# EAGLE design imp-watt-meter (EAGLE 7.4.0)
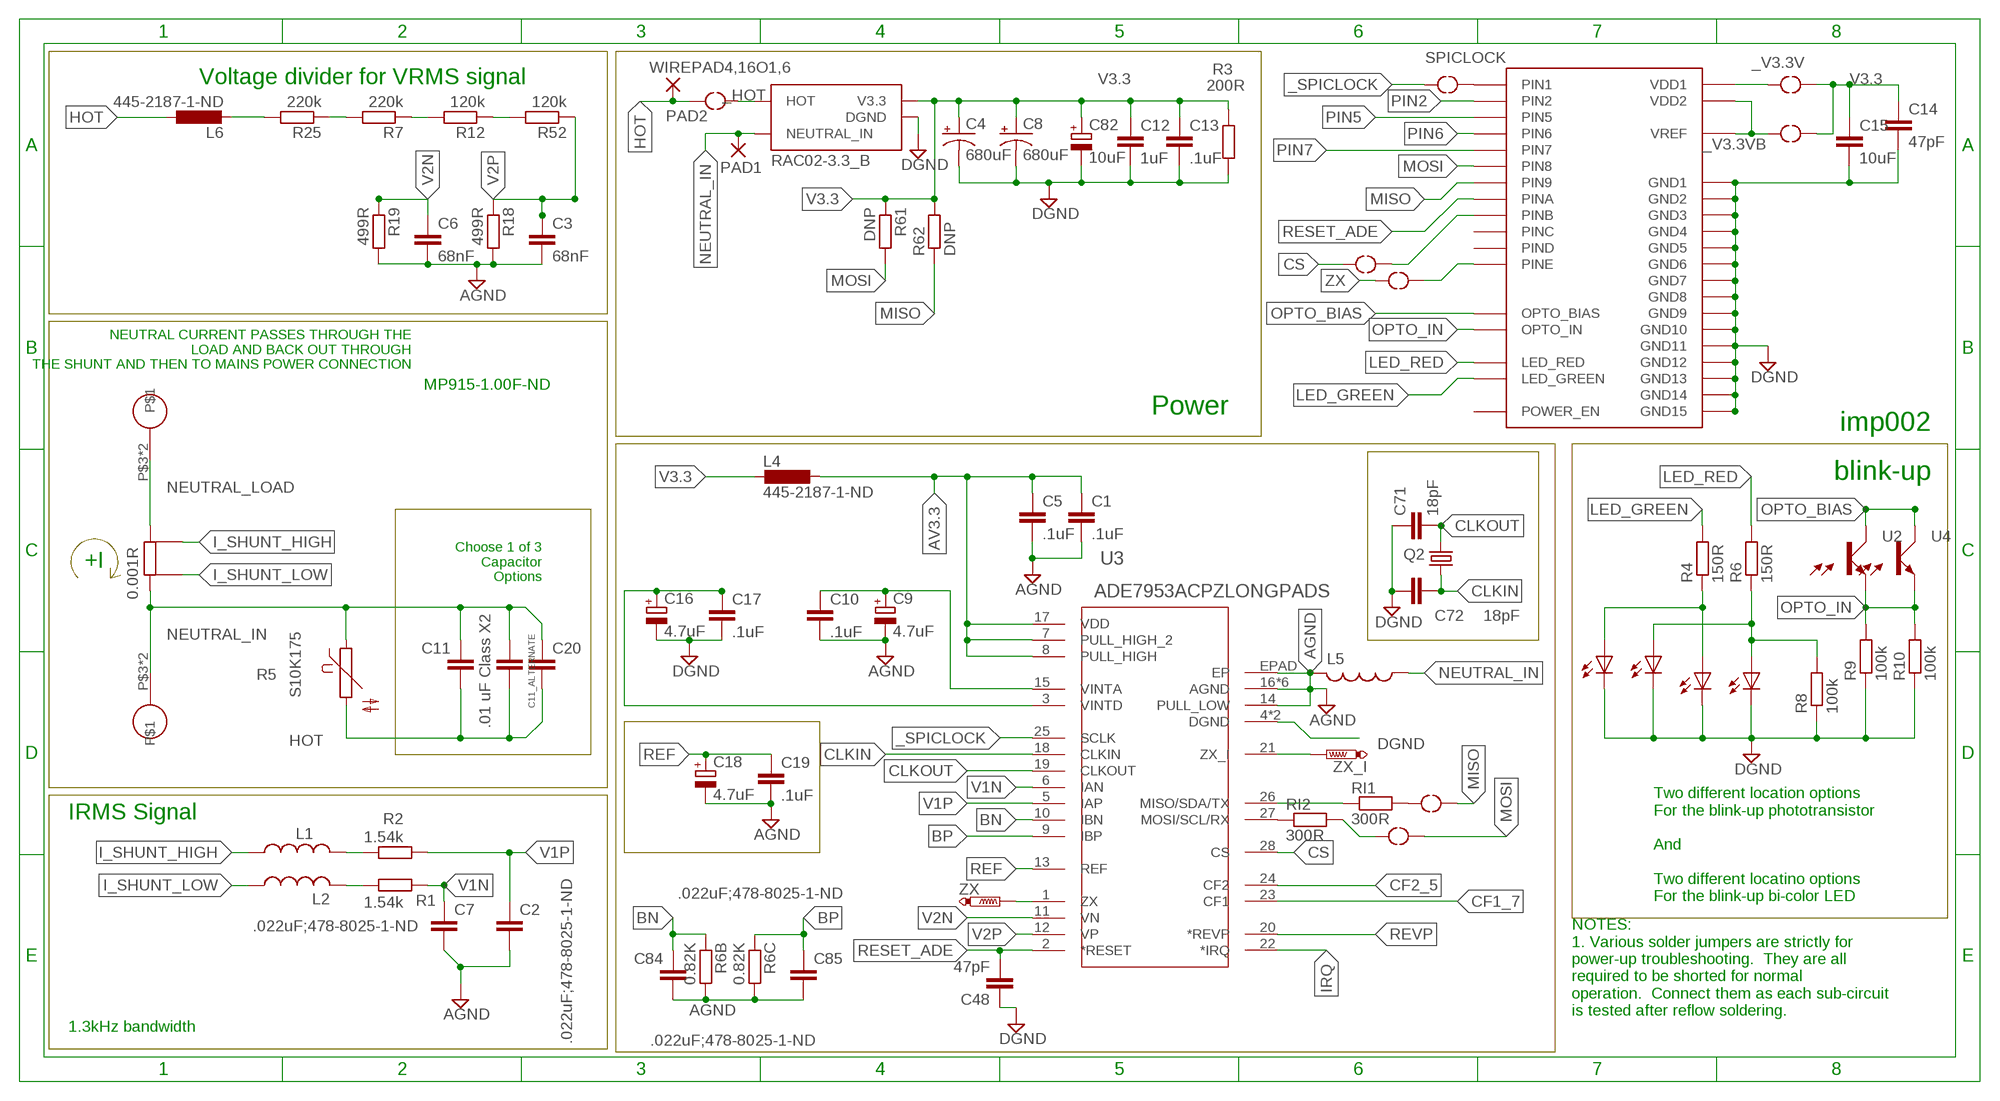
[diagram p0: schematic, sheet 1]

## Parts
0.001R  WSLP2726L5000FEA  [WSLP276_VISHAY]
C1  .1uF  C-EUC0805K  [C0805K@1]
C2  .022uF;478-8025-1-ND  C-EUC0805K  [C0805K@1]
C3  68nF  C-EUC0805K  [C0805K@1]
C4  680uF  CAP_POLD  [PANASONIC_D]
C5  .1uF  C-EUC0805K  [C0805K@1]
C6  68nF  C-EUC0805K  [C0805K@1]
C7  .022uF;478-8025-1-ND  C-EUC0805K  [C0805K@1]
C8  680uF  CAP_POLD  [PANASONIC_D]
C9  4.7uF  CPOL-EUA/3216-18R  [A/3216-18R]
C10  .1uF  C-EUC0805K  [C0805K@1]
C11  .01 uF Class X2  C-EUC2220K  [C2220K]
C11_ALTERNATE  .01 uF Class X2  C-EUC2220K  [C2220K]
C12  1uF  C-EUC1206K  [C1206K]
C13  .1uF  C-EUC0805K  [C0805K@1]
C14  47pF  C-EUC0805K  [C0805K@1]
C15  10uF  CAP1206  [1206]
C16  4.7uF  CPOL-EUA/3216-18R  [A/3216-18R]
C17  .1uF  C-EUC0805K  [C0805K@1]
C18  4.7uF  CPOL-EUA/3216-18R  [A/3216-18R]
C19  .1uF  C-EUC0805K  [C0805K@1]
C20  C10/4  [C10B4]
C48  47pF  C-EUC0805K  [C0805K@1]
C71  18pF  C-EUC0805K  [C0805K@1]
C72  18pF  C-EUC0805K  [C0805K@1]
C82  10uF  CPOL-EUA/3216-18R  [A/3216-18R]
C84  .022uF;478-8025-1-ND  C-EUC0805K  [C0805K@1]
C85  .022uF;478-8025-1-ND  C-EUC0805K  [C0805K@1]
L1  L-USL4516C  [L4516C]
L2  L-USL4516C  [L4516C]
L4  445-2187-1-ND  L-EUL2012C  [L2012C]
L5  L-USL4516C  [L4516C]
L6  445-2187-1-ND  L-EUL2012C  [L2012C]
PAD1  WIREPAD4,16O1,6  [4,16O1,6]
PAD2  WIREPAD4,16O1,6  [4,16O1,6]
Q2  535-10200-1-ND  CRYSTALSM49  [SM49]
R1  1.54k  R-EU_  [C0805K]
R2  1.54k  R-EU_  [C0805K]
R3  200R  R-EU_M1206  [M1206]
R4  150R  R-EU_R0805  [R0805]
R5  S10K175  [S10K175]
R6  150R  R-EU_R0805  [R0805]
R6B  0.82K  R-EU_  [C0805K]
R6C  0.82K  R-EU_  [C0805K]
R7  220k  R-EU_R2010  [R2010]
R8  100k  R-EU_R0805  [R0805]
R9  100k  R-EU_R0805  [R0805]
R10  100k  R-EU_R0805  [R0805]
R12  120k  R-EU_M1206  [M1206]
R18  499R  R-EU_  [C0805K]
R19  499R  R-EU_  [C0805K]
R25  220k  R-EU_R2010  [R2010]
R52  120k  R-EU_M1206  [M1206]
R61  DNP  R-EU_  [C0805K]
R62  DNP  R-EU_  [C0805K]
RI1  300R  R-US_R0805  [R0805@1]
RI2  300R  R-US_R0805  [R0805@1]
U1  LED_DUAL  [LED-BICOLOR]
U2  PHOTOTRANSISTOR0603  [0603]
U3  ADE7953ACPZLONGPADS  ADE7953ACPZ5.0  [VQFN-28-D]
U4  PHOTOTRANSISTOR0603  [0603]
U5  LED_DUAL  [LED-BICOLOR]
U$1  RAC02-3.3_B  [RAC02_B]
U$2  KEYSTONE_FASTON  [KEYSTONE_FASTON_0.25]
U$5  IMP002MANUFACTURING  [IMP002]
U$10  JUMPER2B  [SOLDER_JUMPER2B]
U$11  JUMPER2B  [SOLDER_JUMPER2B]
U$12  JUMPER2B  [SOLDER_JUMPER2B]
U$13  JUMPER2B  [SOLDER_JUMPER2B]
U$15  JUMPER2B  [SOLDER_JUMPER2B]
U$16  JUMPER3  [SOLDER_JUMPER3]
U$17  KEYSTONE_FASTON  [KEYSTONE_FASTON_0.25]
U$18  JUMPER3  [SOLDER_JUMPER3]
U$19  JUMPER2B  [SOLDER_JUMPER2B]
ZX  PTR1TP08R  [TP08R]
ZX_I  PTR1TP08R  [TP08R]

## Nets
_31 [ic]: R12.1 R52.2
_61 [HIGHVOLTAGE]: R7.1 R12.2
_118 [HIGHVOLTAGE]: R7.2 R25.1
_CS [ic]: U$5.PAD9(PINB) U$10.P$1
_HOT [HIGHVOLTAGE]: U$1.P$2(HOT) U$1.P$7(HOT) U$19.P$2
_I2C_CLOCK_1: RI2.2 U$12.P$2
_I2C_DATA_2: RI1.2 U$13.P$2
_PINE: U$5.PAD12(PINE) U$15.P$1
_SPICLOCK [ic]: U3.25(SCLK) U$11.P$2
_V3.3V: U$5.PAD18(VDD1) U$16.P$2
_V3.3VB: U$5.PAD33(VDD2) U$5.PAD34(VREF) U$18.P$2
AGND: C1.2 C2.2 C3.2 C5.2 C6.2 C7.2 C9.- C10.2 C18.- C19.2 C84.2 C85.2 L5.2 R6B.2 R6C.2 R18.2 R19.2 U3.14(PULL_LOW) U3.16(AGND) U3.29(AGND) U3.30(AGND) U3.31(AGND) U3.32(AGND) U3._AGND(AGND) U3.EPAD(EP)
AV3.3 [ic]: C1.1 C5.1 L4.1 U3.7(PULL_HIGH_2) U3.8(PULL_HIGH) U3.17(VDD)
BN [ic]: C84.1 R6B.1 U3.10(IBN)
BP [ic]: C85.1 R6C.1 U3.9(IBP)
CALIBRATE_HIGH [HIGHVOLTAGE]: L6.2 R25.2
CF1_7 [ic]: U3.23(CF1)
CF2_5 [ic]: U3.24(CF2)
CLKIN [ic]: C72.2 Q2.1 U3.18(CLKIN)
CLKOUT [ic]: C71.2 Q2.2 U3.19(CLKOUT)
CS [ic]: U3.28(CS) U$10.P$2
DGND: C4.- C8.- C12.2 C13.2 C14.2 C15.2 C16.- C17.2 C48.1 C71.1 C72.1 C82.- R3.2 R8.1 R9.1 R10.1 U1.3(C) U1.4(C) U3.4(DGND) U3._DGND(DGND) U5.3(C) U5.4(C) U$1.P$3(DGND) U$1.P$5(DGND) U$1.P$8(DGND) U$1.P$10(DGND) U$5.PAD1(GND1) U$5.PAD7(GND2) U$5.PAD13(GND3) U$5.PAD17(GND4) U$5.PAD23(GND5) U$5.PAD24(GND6) U$5.PAD25(GND7) U$5.PAD26(GND8) U$5.PAD27(GND9) U$5.PAD28(GND10) U$5.PAD29(GND11) U$5.PAD30(GND12) U$5.PAD31(GND13) U$5.PAD32(GND14) U$5.PAD35(GND15)
HOT [HIGHVOLTAGE]: C11.1 C11_ALTERNATE.1 C20.2 L6.1 PAD2.1(P) R5.2 U$19.P$1
I_SHUNT_HIGH [ic]: 0.001R.P$3 L1.1
I_SHUNT_LOW [ic]: 0.001R.P$4 L2.1
IRQ [ic]: U3.22(*IRQ)
LED_GREEN: R4.2 U$5.PAD3(LED_GREEN)
LED_RED: R6.2 U$5.PAD4(LED_RED)
MISO: R62.1 U$5.PAD14(PIN9) U$13.P$1
MOSI: R61.2 U$5.PAD22(PIN8) U$12.P$1
N$1: L1.2 R2.2
N$2: R4.1 U1.1(A) U5.1(A)
N$3: R6.1 R8.2 U1.2(A) U5.2(A)
NEUTRAL_IN: 0.001R.P$2 0.001R.P$8 0.001R.P$9 0.001R.P$10 C11.2 C11_ALTERNATE.2 C20.1 L5.1 PAD1.1(P) R5.1 U$1.P$1(NEUTRAL_IN) U$1.P$6(NEUTRAL_IN) U$17.P$3 U$17.P$4
NEUTRAL_LOAD: 0.001R.P$1 0.001R.P$5 0.001R.P$6 0.001R.P$7 U$2.P$3 U$2.P$4
OPTO_BIAS: U2.1(C) U4.1(C) U$5.PAD2(OPTO_BIAS)
OPTO_IN: R9.2 R10.2 U2.2(E) U4.2(E) U$5.PAD6(OPTO_IN)
PIN2: U$5.PAD16(PIN2)
PIN5: U$5.PAD19(PIN5)
PIN6: U$5.PAD20(PIN6)
PIN7: U$5.PAD21(PIN7)
PIN26_MISO_SDA_TX [ic]: RI1.1 U3.26(MISO/SDA/TX)
PIN27_MOSI_SCL_RX [ic]: RI2.1 U3.27(MOSI/SCL/RX)
REF [ic]: C18.+ C19.1 U3.13(REF)
RESET_ADE [ic]: C48.2 U3.2(*RESET) U$5.PAD8(PINA)
REVP [ic]: U3.20(*REVP)
SDFSDF: L2.2 R1.2
SPICLOCK [ic]: U$5.PAD15(PIN1) U$11.P$1
V1N [ic]: C7.1 R1.1 U3.6(IAN)
V1P [ic]: C2.1 R2.1 U3.5(IAP)
V2N [ic]: C6.1 R19.1 U3.11(VN)
V2P [ic]: C3.1 R18.1 R52.1 U3.12(VP)
V3.3: C4.+ C8.+ C12.1 C13.1 C14.1 C15.1 C82.+ L4.2 R3.1 R61.1 R62.2 U$1.P$4(V3.3) U$1.P$9(V3.3) U$16.P$1 U$18.P$1
VINTA_DCPL [ic]: C9.+ C10.1 U3.15(VINTA)
VINTD_DCPL [ic]: C16.+ C17.1 U3.3(VINTD)
ZX [ic]: U3.1(ZX) U$15.P$2 ZX.TP
ZX_I [ic]: U3.21(ZX_I) ZX_I.TP
Unconnected: U$5.PAD5(POWER_EN) U$5.PAD10(PINC) U$5.PAD11(PIND)

## Notes on the sheet
- Voltage divider for VRMS signal
- NEUTRAL CURRENT PASSES THROUGH THE
  LOAD AND BACK OUT THROUGH
  THE SHUNT AND THEN TO MAINS POWER CONNECTION
- MP915-1.00F-ND
- Power
- imp002
- blink-up
- Choose 1 of 3
  Capacitor
  Options
- +I
- IRMS Signal
- Two different location options
  For the blink-up phototransistor
  
  And
  
  Two different locatino options
  For the blink-up bi-color LED
- NOTES:
  1. Various solder jumpers are strictly for
  power-up troubleshooting.  They are all
  required to be shorted for normal
  operation.  Connect them as each sub-circuit
  is tested after reflow soldering.
- 1.3kHz bandwidth

## Library data of the parts
0.001R = marks:WSLP2726L5000FEA
C1-C3 C5-C7 C10 C12-C14 C17 C19 C48 C71 C72 C84 C85 = resistor:C-EU: CAPACITOR, European symbol
C4 C8 = SparkFun-Passives:CAP_POL: Capacitor Polarized These are standard SMD and PTH capacitors. Normally 10uF, 47uF, and 100uF in electrolytic and tantalum varieties. Always verify the external diameter of the through hole cap, it varies with capacity, voltage, and manufacturer. The EIA devices should be standard.
C9 C16 C18 C82 = resistor:CPOL-EU: POLARIZED CAPACITOR, European symbol
C11 C11_ALTERNATE = rcl:C-EU: CAPACITOR, European symbol
C15 = SparkFun-Passives:CAP: Capacitor Standard 0603 ceramic capacitor, and 0.1" leaded capacitor.
C20 = capacitor-wima:C: CAPACITOR naming: grid - package width
L1 L2 L5 = rcl:L-US: INDUCTOR, American symbol
L4 L6 = resistor:L-EU: INDUCTOR, European symbol
PAD1 PAD2 = wirepad-marks:WIREPAD: Wire PAD connect wire on PCB
Q2 = crystal:CRYSTAL: CRYSTAL; OC_FARNELL: unknown; OC_NEWARK: unknown
R1-R4 R6 R6B R6C R7-R10 R12 R18 R19 R25 R52 R61 R62 = resistor:R-EU_: RESISTOR, European symbol
R5 = marks:S10K175: VARISTOR
RI1 RI2 = resistor:R-US_: RESISTOR, American symbol
U1 U5 = marks:LED_DUAL
U2 U4 = marks:PHOTOTRANSISTOR0603
U3 = ade7953-2:ADE7953ACPZ
U$1 = recom-international:RAC02-3.3_B
U$2 U$17 = marks:KEYSTONE_FASTON
U$5 = smARtMAKER_Electrc_Imp:IMP002: The imp is a complete wireless network node in a module. It is available both in a memory card form-factor (imp001) and in a solder-down module form-factor (imp002). It works in conjunction with the imp service to allow easy connection of any device to the internet. This component is the solder down module imp002. Download and updates for the component: http://smartmaker.org/wiki/Projects:Eagle_Libraries:imp002 Specifications for the Electric Imp: http://devwiki.electricimp.com/doku.php?id=specs Author: Dimitri Albino - dimitri@smartmaker.org
U$10-U$13 U$15 U$19 = marks:JUMPER2B
U$16 U$18 = marks:JUMPER3
ZX ZX_I = testpad:PTR1: TEST PIN

## Net classes
0 default: width 0.203 mm, drill 0.508 mm, clearance 0.254 mm
1 HIGHVOLTAGE: width 0.254 mm, drill 0.508 mm, clearance 2.413 mm to class 0, clearance 1.27 mm
2 ic: width 0.152 mm, drill 0.305 mm, clearance 0.152 mm to class 0, clearance 2.413 mm to class 1, clearance 0.152 mm

## Board
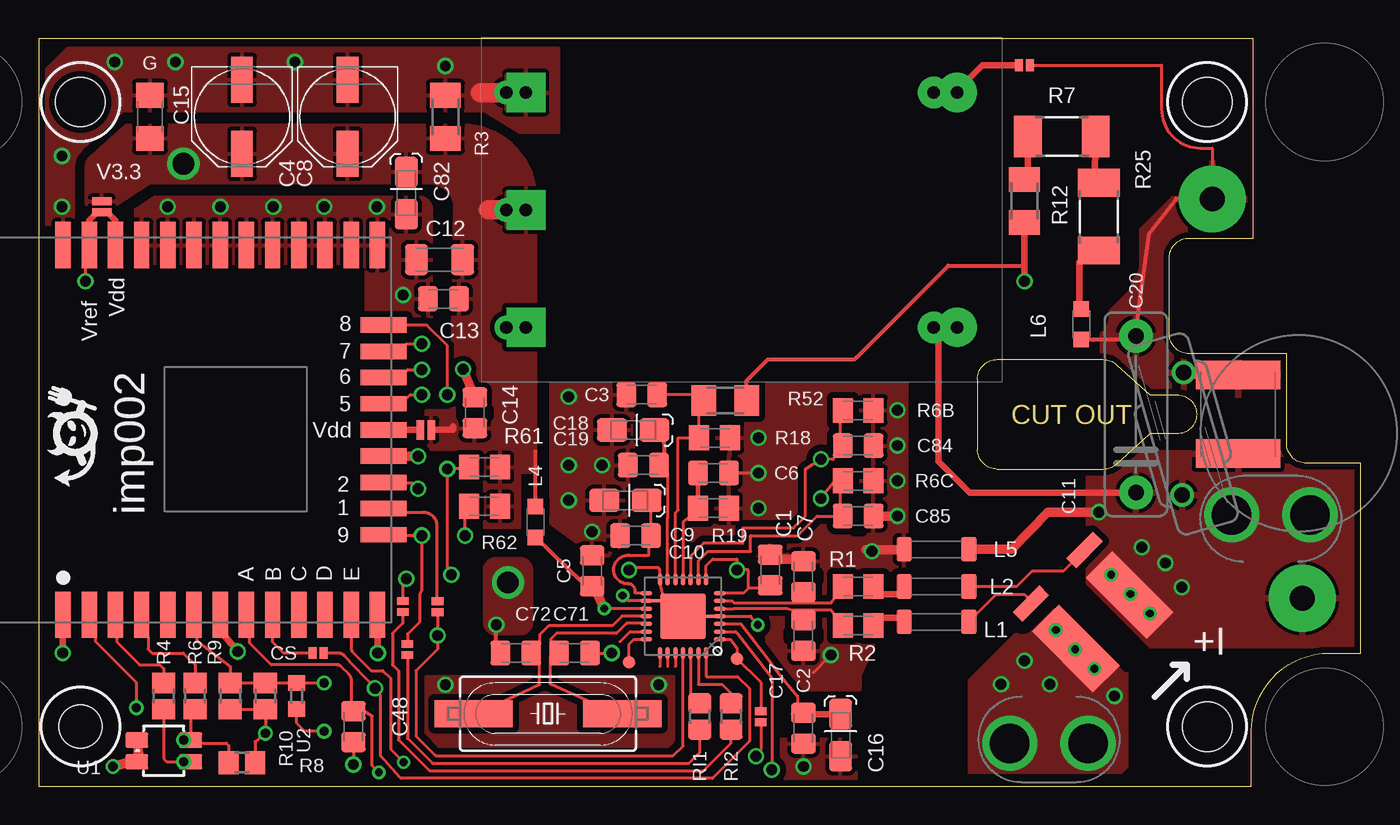
[diagram p1: board, top side]
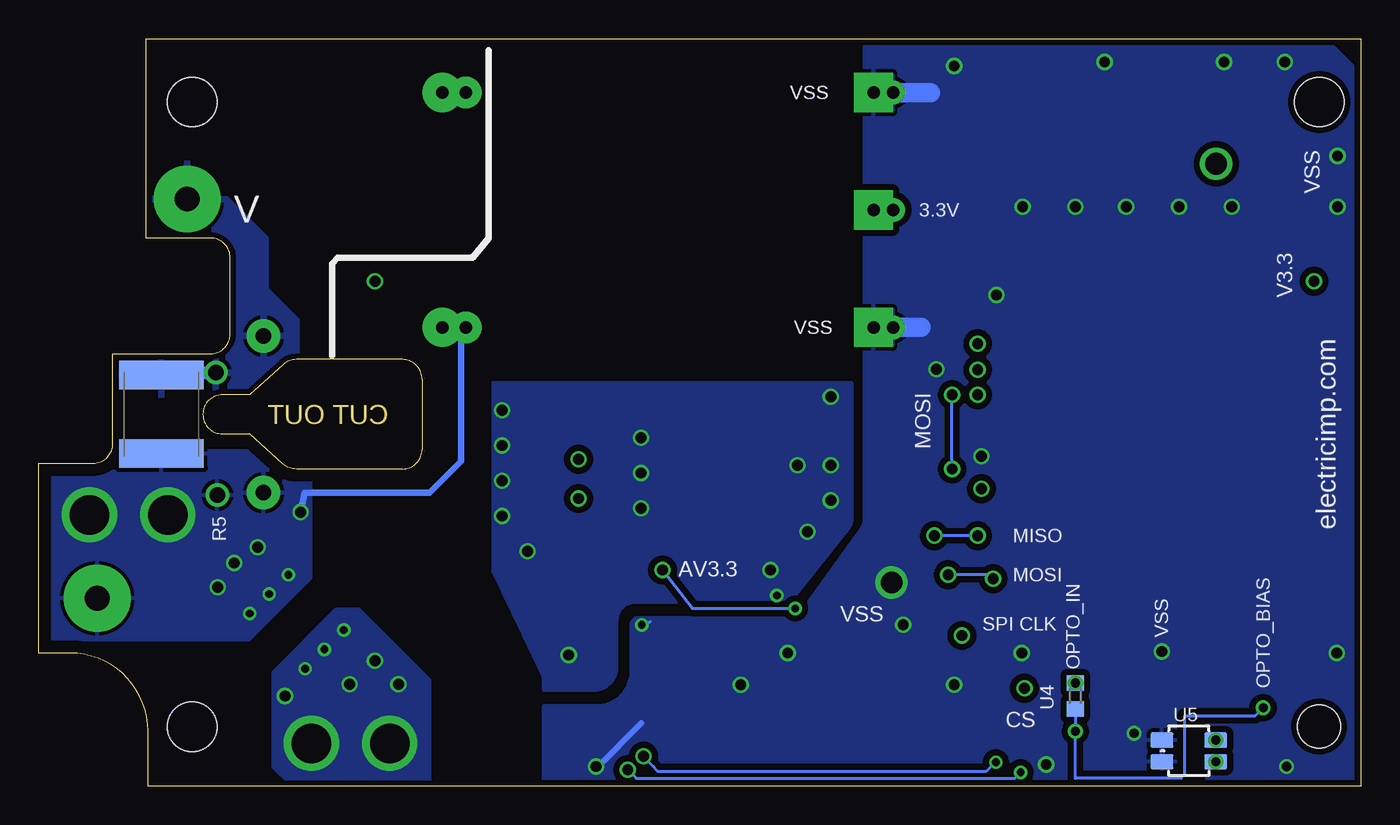
[diagram p2: board, bottom side, seen from below]

Size 85.85 x 48.51 mm. Coordinates in mm from the lower left corner, seen from the top.
Outline: 81.03,28.07 74.68,28.07 arc-90 73.41,29.34 73.41,34.29 arc-90 74.68,35.56 78.87,35.56 78.87,48.51 0,48.51 0,0 78.74,0 78.74,3.56 arc-90 83.82,8.64 85.85,8.64 85.85,20.96 82.3,20.96 arc-90 81.03,22.23 81.03,28.07
Outline: 62.23,27.69 69.11,27.69 arc-42 69.96,27.36 72.14,25.4 73.91,25.4 arc-180 73.91,22.86 72.14,22.86 69.96,20.9 arc-42 69.11,20.57 62.23,20.57 arc-90 60.96,21.84 60.96,26.42 arc-90 62.23,27.69
Copper layers (1*16): Top 0.0356mm / dielectric 1.5011mm / Bottom 0.0356mm
Design rules "LaenPCBOrder2014 *": minimum track width 6mil, minimum drill 13mil, track to track 8mil, track to pad 8mil, pad to pad 8mil, via to via 10mil, smd to smd 8mil, copper to edge 15mil, drill to drill 6mil, minimum pad ring 7mil, minimum via ring 7mil, stop-mask expansion 3mil, vias tented up to drill 0mil, thermal gap 10mil
Holes 2.8 mm at 2.72,3.86
Holes 3.2 mm at 2.72,44.4 75.87,3.86 75.87,44.4
tRestrict: area 3.8,12.8 to 20.8,33.4; area 44.2,23.9 to 45,26.2; area 48,4.1 to 48.5,6.1
bRestrict: area 10.5,0.4 to 10.9,4.1

### Footprints (pad centres in the part's own frame; a part is rotated, then mirrored left to right if it is on the bottom)
WSLP276_VISHAY = smd 5.588 x 2.438: P$1 0,2.464; P$2 0,-2.464 | smd 0.889 x 2.438: P$3 4.128,2.464; P$4 4.128,-2.464 | drill 0.508: P$5 -1.778,2.54; P$6 1.778,2.54; P$7 0,2.54; P$8 -1.778,-2.54; P$9 0,-2.54; P$10 1.778,-2.54
C0805K@1 = smd 1.3 x 1.6: 1 -1,0; 2 1,0
PANASONIC_D = smd 3 x 1.4: + 2.4,0; - -2.4,0
A/3216-18R = smd 1.95 x 1.5: + 1.375,0; - -1.375,0
C2220K = smd 1.85 x 5.5: 1 -2.55,0; 2 2.55,0
C1206K = smd 1.5 x 2: 1 -1.5,0; 2 1.5,0
1206 = smd 1.6 x 1.8: 1 -1.4,0; 2 1.4,0
C10B4 = drill 1.016 pad 2.159: 1 -5.08,0; 2 5.08,0
L4516C = smd 1 x 1.6: 1 -2.1,0; 2 2.1,0
L2012C = smd 1 x 1: 1 -1,0; 2 1,0
4,16O1,6 = drill 1.6 pad 4.318: 1 0,0
SM49 = smd 5.08 x 1.778: 1 -4.826,0; 2 4.826,0
C0805K = smd 1.3 x 1.6: 1 -1,0; 2 1,0
M1206 = smd 1.6 x 2: 1 -1.4,0; 2 1.4,0
R0805 = smd 1.3 x 1.5: 1 -0.85,0; 2 0.85,0
S10K175 = drill 1.016: 1 -1.143,-3.81; 2 1.143,3.81
R2010 = smd 1.8 x 2.7: 1 -2.2,0; 2 2.2,0
R0805@1 = smd 1.3 x 1.5: 1 -0.85,0; 2 0.85,0
LED-BICOLOR = smd 1.5 x 1: 1 -1.75,0.7; 2 -1.75,-0.7; 3 1.75,0.7; 4 1.75,-0.7
0603 = smd 1 x 1.1: 1 -0.85,0; 2 0.85,0
VQFN-28-D = smd 0.813 x 0.305: 1 -2.388,1.5; 2 -2.388,1; 3 -2.388,0.5; 4 -2.388,0; 5 -2.388,-0.5; 6 -2.388,-1; 7 -2.388,-1.5; 15 2.388,-1.5; 16 2.388,-1; 17 2.388,-0.5; 18 2.388,0; 19 2.388,0.5; 20 2.388,1; 21 2.388,1.5 | smd 0.305 x 0.813: 8 -1.5,-2.388; 9 -1,-2.388; 10 -0.5,-2.388; 11 0,-2.388; 12 0.5,-2.388; 13 1,-2.388; 14 1.5,-2.388; 22 1.5,2.388; 23 1,2.388; 24 0.5,2.388; 25 0,2.388; 26 -0.5,2.388; 27 -1,2.388; 28 -1.5,2.388 | smd 1.016 x 1.016: 29 -0.762,0.762; 30 -0.762,-0.762; 31 0.762,0.762; 32 0.762,-0.762 | smd 0.762 x 0.203: _AGND 1.778,-1; _DGND -1.651,0 | smd 2.946 x 2.946: EPAD 0,0
RAC02_B = drill 0.8 pad 2.54: P$1 0,7.62; P$2 0,-7.62 | drill 0.8 pad 2.54 square: P$3 28,7.62; P$4 28,0; P$5 28,-7.62 | drill 0.8 pad 2.032: P$6 1.524,7.62; P$7 1.524,-7.62 | drill 0.8 pad 1.524: P$8 29.27,7.62; P$9 29.27,0; P$10 29.27,-7.62
KEYSTONE_FASTON_0.25 = drill 2.565: P$3 -2.54,0.635; P$4 2.54,0.635
IMP002 = smd 3 x 1: PAD1 -12,7.8; PAD2 -12,6.1; PAD3 -12,4.4; PAD4 -12,2.7; PAD5 -12,1; PAD6 -12,-0.7; PAD7 -12,-2.4; PAD8 -12,-4.1; PAD9 -12,-5.8; PAD10 -12,-7.5; PAD11 -12,-9.2; PAD12 -12,-10.9; PAD13 -12,-12.6; PAD23 12,-12.6; PAD24 12,-10.9; PAD25 12,-9.2; PAD26 12,-7.5; PAD27 12,-5.8; PAD28 12,-4.1; PAD29 12,-2.4; PAD30 12,-0.7; PAD31 12,1; PAD32 12,2.7; PAD33 12,4.4; PAD34 12,6.1; PAD35 12,7.8 | smd 1 x 3: PAD14 -6.8,-13; PAD15 -5.1,-13; PAD16 -3.4,-13; PAD17 -1.7,-13; PAD18 0,-13; PAD19 1.7,-13; PAD20 3.4,-13; PAD21 5.1,-13; PAD22 6.8,-13
SOLDER_JUMPER2B = smd 0.508 x 0.762: P$1 -0.356,0; P$2 0.356,0
SOLDER_JUMPER3 = smd 1.27 x 0.508: P$1 0,0.356; P$2 0,-0.356
TP08R = smd 0.8 x 0.8: TP 0,0

### Placement (x,y rotation side)
0.001R  69.09,10.67 135 top
C1  47.5,14.02 90 top
C2  49.66,9.78 270 top
C3  39.17,25.4 180 top
C4  13.21,43.43 270 top
C5  35.94,13.97 90 top
C6  43.81,20.32 0 top
C7  49.66,13.59 90 top
C8  20.07,43.43 270 top
C9  38.1,18.54 0 top
C10  38.76,16.26 180 top
C11  77.88,24.13 270 top
C11_ALTERNATE  77.88,24.13 270 bottom
C12  26.04,34.16 180 top
C13  26.29,31.62 180 top
C14  28.32,24.23 90 top
C15  7.24,43.43 90 top
C16  52.07,3.3 90 top
C17  49.66,3.76 270 top
C18  38.61,23.11 0 top
C19  39.27,20.83 180 top
C20  71.25,24.13 90 top
C48  20.45,3.86 90 top
C71  34.8,8.64 180 top
C72  30.99,8.64 0 top
C82  23.88,38.48 90 top
C84  53.21,22.1 0 top
C85  53.21,17.53 0 top
L1  58.29,10.67 180 top
L2  58.29,12.95 180 top
L4  32.26,17.14 90 top
L5  58.29,15.37 180 top
L6  67.69,29.97 90 top
PAD1  82.04,12.19 0 top
PAD2  76.2,38.1 0 top
Q2  33.07,4.7 0 top
R1  53.21,12.95 0 top
R2  53.21,10.41 0 top
R3  26.42,43.43 90 top
R4  8.13,5.84 90 top
R5  74.3,22.86 16 top
R6  10.16,5.84 90 top
R6B  53.21,24.38 0 top
R6C  53.21,19.81 0 top
R7  66.42,42.16 0 top
R8  13.21,1.52 180 top
R9  12.45,5.84 90 top
R10  14.73,5.84 90 top
R12  64.01,37.97 90 top
R18  43.89,22.61 0 top
R19  43.81,18.03 0 top
R25  68.83,36.96 270 top
R52  44.58,25.02 0 top
R61  28.96,20.7 180 top
R62  28.96,18.16 0 top
RI1  42.93,4.52 270 top
RI2  44.96,4.52 270 top
U1  8.13,2.29 180 top
U2  16.76,5.84 90 top
U3  41.84,11.03 180 top
U4  18.54,5.84 90 bottom
U5  11.18,2.29 180 bottom
U$1  59.64,37.39 180 top
U$2  65.59,3.41 180 top
U$5  9.4,23.11 90 top
U$10  18.16,8.64 0 top
U$11  25.91,11.63 270 top
U$12  23.65,11.66 270 top
U$13  23.95,8.86 270 top
U$15  46.89,4.49 90 top
U$16  25.15,23.11 270 top
U$17  80,16.97 0 top
U$18  4.11,37.59 0 top
U$19  64.01,46.79 180 top
ZX  45.34,8.28 0 top
ZX_I  38.34,8.03 90 top

### Tracks (layer width: path | path; a pad name or v marks a point on that pad's centre or on a via)
_31  (via drill 0.7)
  Top 0.254: R52.2 45.98,26.31 47.35,27.69 52.58,27.69 52.96,27.69 53.09,27.81 59.05,33.78 64.01,33.78
  Top 0.406: R12.1 64.01,33.78 v64.01,32.77
_61
  Top 0.406: R7.1 64.22,39.08 R12.2
_118
  Top 0.406: R7.2 68.58,39.12 68.83,39.12 68.62,38.82 69.09,38.61 69.05,38.61 R25.1
_CS
  Top 0.203: 15.24,11.07 U$5.PAD9 15.2,9.34 15.9,8.64 U$10.P$1
_HOT
  Top 0.406: U$19.P$2 61.27,46.79 59.69,45.21 U$1.P$2 U$1.P$7
_I2C_CLOCK_1
  Top 0.203: U$12.P$2 23.65,10.57 22.99,9.91 22.99,7.87 23.37,7.49 23.37,3 25.4,0.99 43.16,0.99 44.96,2.79 RI2.2
_I2C_DATA_2
  Top 0.203: U$13.P$2 23.95,3.09 25.57,1.47 42.22,1.47 42.93,2.18 RI1.2
_PINE  (via drill 0.51, 0.7)
  Top 0.203: U$15.P$1 46.89,2.39 v46.58,1.93 | U$5.PAD12 20.3,8.97 arc45 20.43,8.65 21.59,7.49 22.35,7.49 22.86,6.99 22.86,2.39 v23.7,1.55
  Bottom 0.203: v23.7,1.55 24.33,0.96 45.67,0.96 45.92,1.27 v46.58,1.93
_SPICLOCK  (via drill 0.7)
  Top 0.203: U$11.P$2 v25.91,9.78 25.91,8.89 24.51,7.49 24.51,3.25 25.78,1.98 41.2,1.98 41.84,2.59 U3.25
_V3.3V
  Top 0.406: U$5.PAD18 U$16.P$2
_V3.3VB  (via drill 0.7)
  Top 0.203: 3.05,33.91 v3.05,32.77
  Top 0.406: 5.08,35.11 U$5.PAD33 4.98,35.13 4.98,36.73 4.5,37.21 U$18.P$2 | U$5.PAD34 | 3.68,37.21 U$18.P$2 | 3.05,33.91 3.3,34.16 U$5.PAD34 | U$18.P$2 arc90 3.83,37.19 | U$5.PAD34 3.3,36.73 3.79,37.21 U$18.P$2
AGND  (via drill 0.51, 0.7, 0.7 pad 0.51)
  Top 0.203: 40.33,13.46 40.34,13.11 40.58,12.14 40.82,12.03 U3._AGND U3.16 38.3,12.03 v37.92,12.37 | 40.33,13.46 40.33,14.07 40.22,14.18 38.46,14.17 v38.34,14.03 | 54.23,19.56 54.15,19.56 | C84.2 54.21,21.96 54.03,21.89 | C6.2 v46.74,20.32 | U3.29 U3.30 U3.32 | U3.32 U3.31 | U3.EPAD 41.08,11.03 U3.32 | U3.14 40.31,13.46 40.33,13.46 | 50.29,7.37 v51.44,8.51 | v54.1,15.24 53.7,15.35
  Top 0.254: U3.14 | 53.85,21.72 54.03,21.89 | 54.15,19.56 53.9,19.38 53.85,19.43 53.98,19.56 54.15,19.56
  Top 0.406: 40.82,12.03 41.08,12.03 U3.32
  Top 0.61: 53.7,15.35 55.96,15.35 L5.2 | C7.2 arc90 49.51,14.73 47.79,14.73 arc-90 C1.2 | C85.2 v55.75,17.53
  other vias: 34.42,25.27 46.74,22.61 55.75,19.81 55.75,22.1 55.75,24.38 46.74,18.03 35.94,16.51 36.58,20.83 34.42,20.83 34.42,18.54
  pour Top (isolate 0.406): 33.27,17.02 33.27,26.16 56.39,26.16 56.39,13.97 53.34,7.18 53.34,6.22 47.29,6.22 47.29,14.86 37.26,14.86 37.26,13.97 37.08,14.22
  pour Bottom (isolate 0.406): 37.08,11.94 33.27,16.71 arc-39 33.02,17.42 33.02,26.16 56.39,26.16 56.39,13.97 53.09,7.11 53.09,6.22 49.81,6.22 arc-90 48.29,7.75 48.29,10.7 arc90 47.18,11.94
AV3.3  (via drill 0.51, 0.7)
  Top 0.203: U3.8 43.34,13.42 | 43.34,13.42 43.34,14.3 43.77,14.73 45.34,14.73 v45.34,14.03 46.08,14.03 46.08,12.84 | 46.08,12.84 46.08,12.83 45.75,12.53 U3.7 | U3.17 v36.73,11.53 | 43.34,13.42 43.38,13.42 U3.8 | C1.1 47.43,13.15 46.86,12.84 46.08,12.84
  Top 0.254: 39.44,11.52 U3.17 | 36.07,12.95 35.87,12.7 35.56,12.76 35.81,13.06 35.3,12.59 35.31,13.21 L4.1
  Top 0.61: v36.73,11.53 36.07,12.95 35.69,13.08 C5.1
  Bottom 0.203: v45.34,14.03 43.38,11.53 v36.73,11.53
BN  (via drill 0.7)
  Top 0.203: U3.10 42.34,14.92 43.17,15.75 45.72,15.75 45.72,16.76 49.02,16.76 49.78,17.53 49.78,20.57 v50.8,21.21 51.58,21.21 C84.1 52.07,21.72 52.07,23.62 51.96,23.62 R6B.1 | U3.10
BP  (via drill 0.7)
  Top 0.203: 51.94,17.54 51.94,17.65 52.15,17.27 52.21,17.27 C85.1 | U3.9 42.84,14.61 43.47,15.24 46.23,15.24 46.23,16.26 49.28,16.26 50.55,17.53 C85.1 | v50.8,18.67 51.69,19.81 R6C.1 52.21,19.18 52.07,19.18 52.07,17.4 52.21,17.4 C85.1 | 52.21,17.33 C85.1
CALIBRATE_HIGH
  Top 0.406: L6.2 67.56,31.24 67.56,33.99 R25.2
CF1_7
  Top 0.203: U3.23 40.84,7.75
CF2_5
  Top 0.203: U3.24 41.34,7.75
CLKIN
  Top 0.203: Q2.1 29.97,5.41 32.54,6.6 32.54,8.35 C72.2 | U3.18 37.87,11.03 37.26,10.41 33.12,10.41 32.54,9.83 32.54,9.19 C72.2 | 32.18,9.27 C72.2
CLKOUT
  Top 0.203: U3.19 39.41,10.56 38.17,10.56 37.52,9.91 33.62,9.91 33.25,9.53 33.25,9.26 33.71,9.23 C71.2 33.25,8.38 33.25,6.6 35.92,5.41 Q2.2
CS  (via drill 0.7)
  Top 0.203: U3.28 43.34,7.11 45.39,7.11 46.15,6.35 46.15,2.92 43.76,0.51 23.52,0.51 22.2,1.96 22.2,5.87 v21.84,6.35 19.87,8.44 arc47 19.41,8.64 U$10.P$2
DGND  (via drill 0.51, 0.6, 0.7, 1.4)
  Top 0.203: C71.1 v37.21,8.64 | U$5.PAD35 1.7,36.49 | U$5.PAD7 11.86,11.81 | v46.69,10.46 46.23,11.03 43.28,11.02 43.28,11.03 U3._DGND U3.4 | U$5.PAD31 8.31,35.05 8.3,35.09 | C48.1 v20.45,1.4 | 22.48,21.41 22.43,21.41 U$5.PAD17 | R9.1 R10.1 v14.73,3.43 14.06,2.88 R8.1
  Top 0.254: C72.1 29.64,9.07 29.72,9.14 v29.72,10.46
  Top 0.406: 11.86,11.81 11.94,11.74 | U$5.PAD13 v22.02,8.64 | v12.93,8.74 11.8,10.1 U$5.PAD7 | 1.57,10.37 v1.57,8.64 | C17.2 49.82,2.76 | 6.6,1.78 6.82,1.27 U1.4 U1.3
  Top 0.61: v24.64,21.41 22.48,21.41 | v27.56,27.05 C14.2 | 6.6,1.78 v4.83,1.27
  Top 0.813: U$5.PAD1 1.7,11.05 1.6,10.69 1.6,10.39 1.57,10.37
  Top 1.27: U$1.P$5 28.7,45.01
  Bottom 0.203: v46.69,10.46 46.15,10.67
  Bottom 0.406: v49.66,1.27 49.53,1.27 46.74,4.06
  Bottom 1.27: U$1.P$3 28.57,29.77 | U$1.P$5 27.94,45.01
  other vias: 1.52,37.59 4.95,46.99 8.89,46.99 16.64,46.99 26.42,46.74 1.52,40.89 8.38,37.59 11.81,37.59 15.24,37.59 18.54,37.59 21.97,37.59 23.67,31.88 40.26,6.58 26.42,6.58 30.48,13.21
  pour Bottom (isolate 0.406): 0.18,0.38 0.18,46.41 1.9,48.13 32.26,48.13 32.26,17.45 arc36 32.56,16.53 36.63,10.92 46.92,10.92 arc-90 47.42,10.42 47.42,7.39 arc90 49.6,5.21 53.09,5.21 53.09,0.38
  pour Top (isolate 0.406): 33.78,42.42 33.78,47.88 1.86,47.88 0.43,46.45 0.43,36.45 2.29,36.45 2.29,40.14 arc-47 2.8,41.31 5.51,43.81 28.96,43.81 31.24,42.42
  pour Top (isolate 0.406): 25.53,30.23 25.53,37.26 arc90 24.81,38.23 7.48,38.23 6.27,37.4 6.27,33.27 21.13,33.15 21.13,30.23
  pour Top (isolate 0.406): 25.15,7.06 25.15,2.54 40.46,2.54 arc90 41.27,3.35 41.27,7.06
  pour Top (isolate 0.406): 48.01,3.05 48.01,-0.25 53.09,-0.25 53.09,3.05
  pour Top: 32,10.67 32,13.97 arc90 31.24,14.73 29.72,14.73 arc90 28.96,13.97 28.96,10.67 arc90 29.72,9.91 31.24,9.91 arc90
HOT
  Top 0.203: U$19.P$1 72.9,46.79 72.9,43.94 arc90 75.44,41.4 76.2,41.4 PAD2.1
  Top 0.254: L6.1 68.45,28.96 71.37,28.96 C20.2 71.37,30.73 72.08,35.84 73.86,38.12 74.68,38.1 PAD2.1
  Top 0.813: C11_ALTERNATE.1 76.11,26.84 R5.2
  Bottom 0.61: C11_ALTERNATE.1 75.45,26.84
  Bottom 0.813: 75.45,26.84 R5.2
  pour Top: 81.03,25.4 81.03,40.39 75.95,40.39 71.12,35.56 71.12,32.26 69.09,30.23 69.09,25.4
  pour Bottom: 81.03,25.4 81.03,40.39 75.95,40.39 71.12,35.56 71.12,32.26 69.09,30.23 69.09,25.4
I_SHUNT_HIGH
  Top 0.203: L1.1 62.17,12.45 64.01,12.45 64.54,11.92 0.001R.P$3
I_SHUNT_LOW
  Top 0.203: L2.1 62.48,12.95 63.52,12.97 64.52,13.97 66.55,13.97 0.001R.P$4
IRQ
  Top 0.203: U3.22 40.34,7.75
LED_GREEN
  Top 0.203: U$5.PAD3 5.08,11.03 5.08,9.35 6.56,7.87 7.87,7.87 8.13,7.62 R4.2
LED_RED
  Top 0.203: U$5.PAD4 6.86,10.95 6.86,9.91 7.11,9.65 7.11,8.89 7.37,8.64 9.4,8.64 10.16,7.87 R6.2
MISO  (via drill 0.7)
  Top 0.203: 23.29,16.26 22.4,16.26 U$5.PAD14 | 23.29,16.26 U$5.PAD14 | 23.29,16.26 23.32,16.23 | U$5.PAD14 22.4,16.26 v24.89,16.26 24.89,12.7 24.77,12.45 24.77,10.67 23.95,9.86 U$13.P$1 | v27.69,16.26 27.7,16.53 27.69,16.53 27.69,18.03 R62.1
  Bottom 0.203: v24.89,16.26 v27.69,16.26
MOSI  (via drill 0.7)
  Top 0.203: 22.4,29.72 U$5.PAD22 25.2,29.91 26.54,28.57 v26.54,25.4 | v26.8,13.72 26.67,13.72 26.54,13.84 v26.54,20.57 26.54,20.62 27.88,20.62 R61.2 27.7,20.83 | v23.88,13.46 23.65,13.21 U$12.P$1
  Bottom 0.203: v23.88,13.46 24.13,13.72 v26.8,13.72 | v26.54,20.57 v26.54,25.4
N$1
  Top 0.406: R2.2 54.36,10.92 56.13,10.92 L1.2
N$2  (via drill 0.6)
  Top 0.203: R4.1 8.13,1.78 8.32,1.59 U5.1
  Top 0.406: U1.1 U5.1
  other vias: 9.43,1.59
N$3  (via drill 0.6)
  Top 0.203: R6.1 9.88,4.77 U1.2 | U1.2 10.45,2.79 | U1.2 10.7,2.79 12.19,2.79 12.36,2.63 R8.2
  Top 0.406: U1.2 U5.2
  other vias: 9.43,2.99
NEUTRAL_IN  (via drill 0.7 pad 0.61)
  Top 0.203: 0.001R.P$2 70.94,12.41 0.001R.P$8
  Top 0.406: 58.42,29.77 58.42,21.08 60.45,19.05 70.1,19.05 | U$1.P$1 58.42,29.77 | 58.42,29.77 U$1.P$6
  Top 0.61: L5.1 63.19,15.37 65.53,17.78 v68.83,17.78
  Bottom 0.406: 58.42,29.77 58.42,21.08 60.45,19.05 68.58,19.05 v68.83,17.78 | U$1.P$1 58.42,29.77 | 58.42,29.77 U$1.P$6
  other vias: 74.22,12.9 71.63,15.49 73.15,14.48
  pour Bottom (isolate 0.813): 86.61,9.53 72.19,9.53 68.2,13.51 68.2,21.72 86.61,21.72
  pour Top (isolate 0.406): 86.61,9.14 72.21,9.14 68.2,13.15 68.2,21.59 86.61,21.59
NEUTRAL_LOAD  (via drill 0.7)
  Top 0.61: 0.001R.P$5 68.15,9.14 0.001R.P$1 | 0.001R.P$7 0.001R.P$6
  other vias: 62.48,6.6 65.66,6.6 64.01,8.13 69.85,5.84
  pour Top (isolate 0.813): 60.45,0.25 60.45,6.86 65.02,11.43 66.55,11.43 70.61,7.37 70.61,5.84 70.61,1.27 69.6,0.25
  pour Bottom: 60.45,0.25 60.45,6.86 65.02,11.43 66.55,11.43 70.61,7.37 70.61,5.84 70.61,1.27 69.6,0.25
OPTO_BIAS  (via drill 0.6)
  Top 0.203: 3.23,12.31 U$5.PAD2 3.68,10.73 3.68,9.4 6.35,6.73 v6.35,5.08 | v18.54,3.56 17.27,3.56 16.76,4.06 U2.1
  Bottom 0.203: U4.1 v18.54,3.56 18.54,0.51 11.68,0.51 11.43,0.76 11.43,4.57 6.86,4.57 v6.35,5.08
OPTO_IN  (via drill 0.6)
  Top 0.203: 9.83,12.12 U$5.PAD6 10.21,10.42 | 10.29,9.91 10.21,10.42 | 10.21,10.42 10.29,10.21 10.29,9.4 12.45,7.75 R9.2 R10.2 U2.2 U4.2
  other vias: 18.54,6.69
PIN2  (via drill 0.7)
  Top 0.203: U$5.PAD16 22.43,19.68 24.26,19.68 v24.64,19.3
PIN5  (via drill 0.7)
  Top 0.203: U$5.PAD19 23.62,24.89 24.13,25.4 v24.89,25.4
PIN6  (via drill 0.7)
  Top 0.203: U$5.PAD20 23.62,26.67 23.98,27.03 v24.89,27.03
PIN7  (via drill 0.7)
  Top 0.203: U$5.PAD21 22.42,28.19 23.37,28.19 23.88,28.7 v24.89,28.7
PIN26_MISO_SDA_TX
  Top 0.203: U3.26 42.34,5.79 42.67,5.92 RI1.1
PIN27_MOSI_SCL_RX
  Top 0.203: U3.27 42.84,6.6 44.37,6.6 44.96,6.02 RI2.1
REF
  Top 0.203: U3.13 40.84,15.47 40.84,15.73 40.84,17.4 40.84,20.32 40.64,20.27 40.59,21.34 | 40.59,22.28 40.59,21.34 | C18.+ 40.59,22.28 | 40.59,21.34 40.27,21.27 C19.1 | 40.59,22.28 40.64,22.23 40.64,21.08
RESET_ADE  (via drill 0.51, 0.7)
  Top 0.203: U3.2 45.27,10.03 45.39,9.91 47.6,7.04 v47.6,1.07 | U$5.PAD8 13.39,10.59 13.72,10.41 13.72,9.27 15.11,7.87 19.39,7.87 arc-45 19.63,7.78 20.16,7.24 arc-45 20.32,6.85 20.32,4.9 20.03,4.61 C48.2 | C48.2 20.83,4.79 | v22.1,0.89 21.67,1.32 21.67,4.55 21.15,4.86 C48.2
  Bottom 0.203: v22.1,0.89 22.48,0.51 47.04,0.51 v47.6,1.07
REVP
  Top 0.203: 38.41,10.03 | 38.41,10.03 U3.20 | 37.74,9.37 38.41,10.03
SDFSDF
  Top 0.406: R1.2 54.36,12.45 56.13,12.45 56.13,12.7 L2.2
SPICLOCK
  Top 0.203: 22.4,17.91 U$5.PAD15 22.4,17.78 24.98,17.78 arc-90 25.86,16.91 25.86,12.04 arc90 U$11.P$1
V1N
  Top 0.203: U3.6 45.02,12.03 45.16,11.89 49.91,11.89 | 49.91,11.89 50.04,11.89 | 50.04,11.89 51.45,11.89 R1.1 | 49.91,11.89 49.77,12.59 C7.1 50.29,12.08 50.04,11.89
  Top 0.254: U3.6
V1P
  Top 0.203: U3.5 45.12,11.53 45.16,11.53 48.54,11.53 48.92,11.43 49.66,11.43 | 52.61,10.78 R2.1 51.45,11.43 49.66,11.43 | 50.19,10.88 C2.1 49.66,11.43
V2N
  Top 0.203: C6.1 42.69,20.57 | 42.85,17.91 41.84,17.14 U3.11
  Top 0.305: C6.1 R19.1
  Top 0.406: 42.85,17.91 42.85,18 R19.1
V2P
  Top 0.203: U3.12 41.33,13.41 41.33,17.7 41.53,17.91 41.53,22.61 R18.1 42.89,24.93 42.42,25.4 C3.1
  Top 0.406: 42.89,24.93 42.89,25.37 R52.1
V3.3  (via drill 1.4)
  Top 0.254: L4.2 32.26,21.72
  Top 0.406: U$16.P$1 26.92,23.11 26.92,23.37
  Top 1.27: U$1.P$4 29.21,37.39
  other vias: 9.4,40.39
  pour Top (isolate 0.305): 3.1,37.72 3.1,40.14 arc-48 3.42,40.87 5.7,42.93 27.49,42.93 arc-90 32.26,38.15 32.26,20.32 31.24,20.32 31.24,16.76 28.96,16.76 28.96,21.84 25.15,21.84 25.15,23.47 25.17,24.38 26.8,24.38 27.02,37.5 arc91 25.43,39.12 7.19,39.12 5.05,37.72
VINTA_DCPL
  Top 0.203: U3.15 38.73,12.53 38.73,12.68 arc90 38.28,13.13 arc-87 37.34,13.97 arc-96 38.35,14.99 39.62,14.99 39.62,16 39.76,16 C10.1 39.76,18.28 C9.+
VINTD_DCPL
  Top 0.152: 49.28,4.95 49.28,4.83 C17.1
  Top 0.203: U3.3 45.61,10.53 47.37,8.26 arc7 49.28,5.84 49.28,4.95 49.28,4.94
  Top 0.406: C16.+ 49.28,4.68 49.53,4.83 49.04,4.7 C17.1
ZX
  Top 0.203: U3.1 44.92,9.53 45.34,8.97 ZX.TP 46.89,6.73 U$15.P$2
  Top 0.254: 45.33,8.16 ZX.TP
ZX_I
  Top 0.203: U3.21 38.66,9.53 38.34,9.21 38.34,8.09 38.61,8.09 ZX_I.TP
  Top 0.254: 38.51,8.09 ZX_I.TP

### Text on the board
Dimension: CUT OUT
tNames: G | V3.3 | Vdd | Vref | Vdd | CS | +I
bNames: VSS | VSS | 3.3V | V | V3.3 | VSS | MOSI | electricimp.com | MISO | MOSI | AV3.3 | VSS | VSS | SPI CLK | OPTO_IN | OPTO_BIAS | CS